# EAGLE schematic speakers2 (EAGLE 5.07)
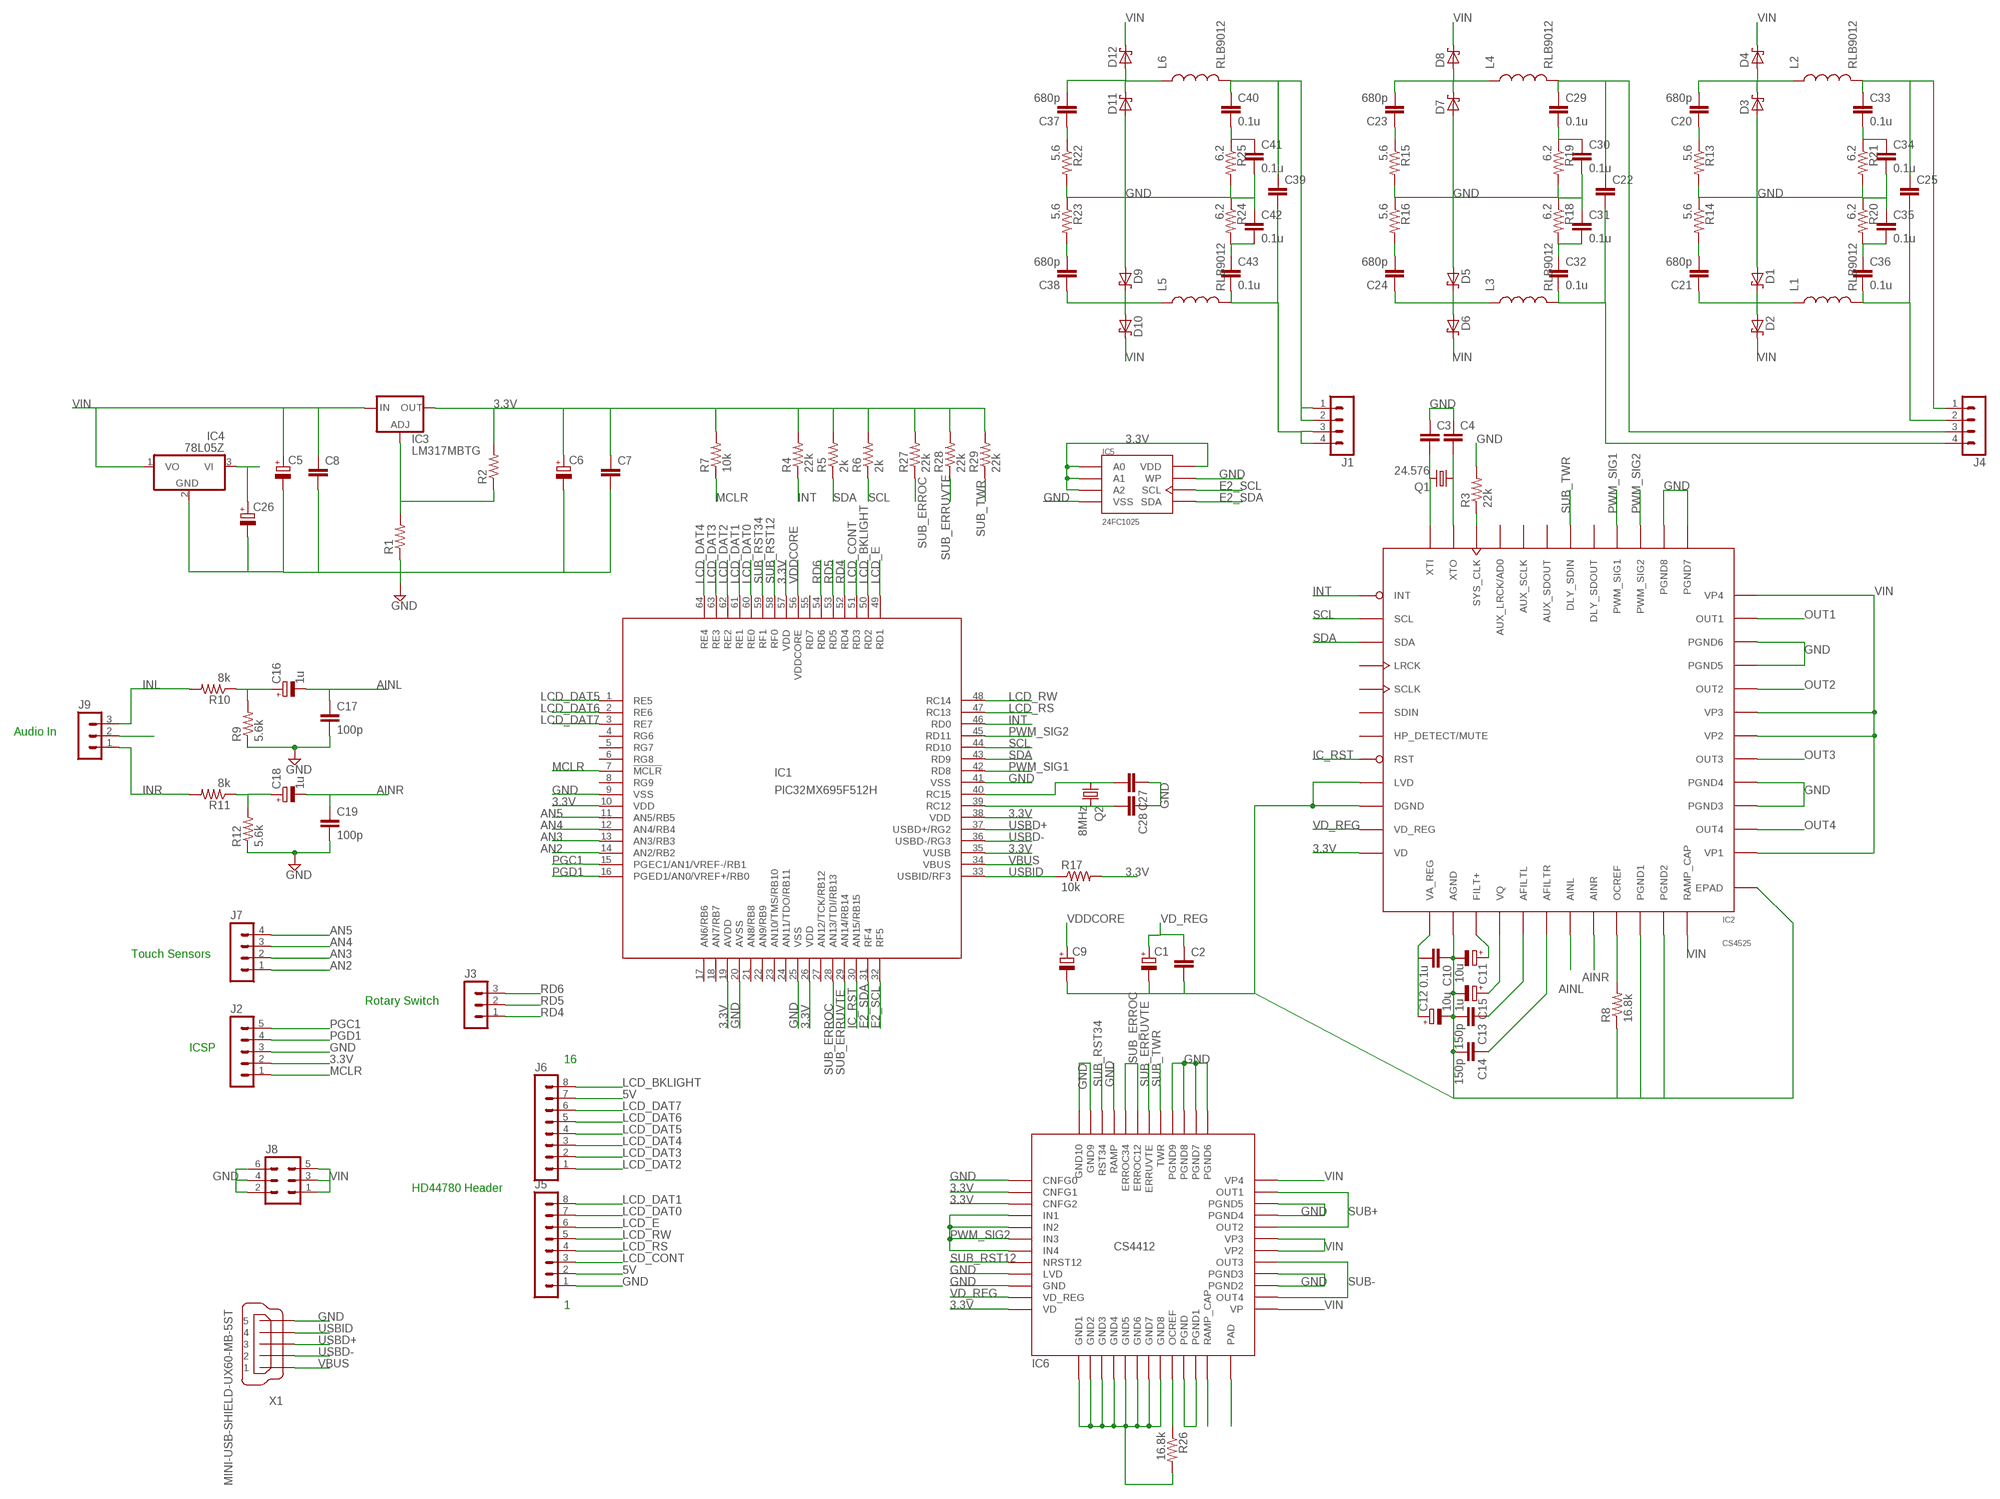
[diagram p0: schematic, sheet 1]

## Parts
C1  CPOL-EUE2-4  [E2-4]
C2  C-EUC0805  [C0805]
C3  C-EUC0805  [C0805]
C4  C-EUC0805  [C0805]
C5  CPOL-EUE2-4  [E2-4]
C6  CPOL-EUE2-4  [E2-4]
C7  C-EUC0805  [C0805]
C8  C-EUC0805  [C0805]
C9  CPOL-EUE2-4  [E2-4]
C10  0.1u  C-EUC0805  [C0805]
C11  10u  CPOL-EUE2-4  [E2-4]
C12  10u  CPOL-EUE2-4  [E2-4]
C13  150p  C-EUC0805  [C0805]
C14  150p  C-EUC0805  [C0805]
C15  1u  CPOL-EUE2-4  [E2-4]
C16  1u  CPOL-EUE2-4  [E2-4]
C17  100p  C-EUC0805  [C0805]
C18  1u  CPOL-EUE2-4  [E2-4]
C19  100p  C-EUC0805  [C0805]
C20  680p  C-EUC0402  [C0402]
C21  680p  C-EUC0402  [C0402]
C22  C-EUC3216  [C3216]
C23  680p  C-EUC0402  [C0402]
C24  680p  C-EUC0402  [C0402]
C25  C-EUC3216  [C3216]
C26  CPOL-EUE2-4  [E2-4]
C27  C-EUC0805  [C0805]
C28  C-EUC0805  [C0805]
C29  0.1u  C-EUC3216  [C3216]
C30  0.1u  C-EUC3216  [C3216]
C31  0.1u  C-EUC3216  [C3216]
C32  0.1u  C-EUC3216  [C3216]
C33  0.1u  C-EUC3216  [C3216]
C34  0.1u  C-EUC3216  [C3216]
C35  0.1u  C-EUC3216  [C3216]
C36  0.1u  C-EUC3216  [C3216]
C37  680p  C-EUC0402  [C0402]
C38  680p  C-EUC0402  [C0402]
C39  C-EUC3216  [C3216]
C40  0.1u  C-EUC3216  [C3216]
C41  0.1u  C-EUC3216  [C3216]
C42  0.1u  C-EUC3216  [C3216]
C43  0.1u  C-EUC3216  [C3216]
D1  SCHOTTKY-DIODESMD  [SMB]
D2  SCHOTTKY-DIODESMD  [SMB]
D3  SCHOTTKY-DIODESMD  [SMB]
D4  SCHOTTKY-DIODESMD  [SMB]
D5  SCHOTTKY-DIODESMD  [SMB]
D6  SCHOTTKY-DIODESMD  [SMB]
D7  SCHOTTKY-DIODESMD  [SMB]
D8  SCHOTTKY-DIODESMD  [SMB]
D9  SCHOTTKY-DIODESMD  [SMB]
D10  SCHOTTKY-DIODESMD  [SMB]
D11  SCHOTTKY-DIODESMD  [SMB]
D12  SCHOTTKY-DIODESMD  [SMB]
IC1  PIC32MX695F512H  [TQFP64-10X10]
IC2  CS4525  [QFN48-9X9]
IC3  LM317MBTG  [TO220L1]
IC4  78L05Z  [TO92]
IC5  24FC1025  [DIL8]
IC6  CS4412  [QFN48-9X9]
J1  MA04-1  [MA04-1]
J2  MA05-1  [MA05-1]
J3  MA03-1  [MA03-1]
J4  MA04-1  [MA04-1]
J5  MA08-1  [MA08-1]
J6  MA08-1  [MA08-1]
J7  MA04-1  [MA04-1]
J8  MA03-2  [MA03-2]
J9  MA03-1  [MA03-1]
L1  RLB9012  [RLB9012]
L2  RLB9012  [RLB9012]
L3  RLB9012  [RLB9012]
L4  RLB9012  [RLB9012]
L5  RLB9012  [RLB9012]
L6  RLB9012  [RLB9012]
Q1  24.576  XTAL-12SMX-B  [12SMX-B]
Q2  8MHz  CRYSTALHC49U-V  [HC49U-V]
R1  R-US_M0805  [M0805]
R2  R-US_M0805  [M0805]
R3  22k  R-US_M0805  [M0805]
R4  22k  R-US_M0805  [M0805]
R5  2k  R-US_M0805  [M0805]
R6  2k  R-US_M0805  [M0805]
R7  10k  R-US_M0805  [M0805]
R8  16.8k  R-US_M0805  [M0805]
R9  5.6k  R-US_M0805  [M0805]
R10  8k  R-US_M0805  [M0805]
R11  8k  R-US_M0805  [M0805]
R12  5.6k  R-US_M0805  [M0805]
R13  5.6  R-US_R0805  [R0805]
R14  5.6  R-US_R0805  [R0805]
R15  5.6  R-US_R0805  [R0805]
R16  5.6  R-US_R0805  [R0805]
R17  10k  R-US_M0805  [M0805]
R18  6.2  R-US_R0805  [R0805]
R19  6.2  R-US_R0805  [R0805]
R20  6.2  R-US_R0805  [R0805]
R21  6.2  R-US_R0805  [R0805]
R22  5.6  R-US_R0805  [R0805]
R23  5.6  R-US_R0805  [R0805]
R24  6.2  R-US_R0805  [R0805]
R25  6.2  R-US_R0805  [R0805]
R26  16.8k  R-US_M0805  [M0805]
R27  22k  R-US_M0805  [M0805]
R28  22k  R-US_M0805  [M0805]
R29  22k  R-US_M0805  [M0805]
X1  MINI-USB-SHIELD-UX60-MB-5ST  [UX60-MB-5ST]

## Nets
3.3V: C6.+ C7.1 IC1.10(VDD) IC1.19(AVDD) IC1.26(VDD) IC1.35(VUSB) IC1.38(VDD) IC1.57(VDD) IC2.12(VD) IC3.2(OUT) IC5.1(A0) IC5.2(A1) IC5.3(A2) IC5.8(VDD) IC6.2(CNFG1) IC6.3(CNFG2) IC6.12(VD) J2.2 R2.2 R4.2 R5.2 R6.2 R7.2 R17.2 R27.2 R28.2 R29.2
5V: C26.+ IC4.3(VI) J5.2 J6.7
AINL: C16.- C17.1 IC2.19(AINL)
AINR: C18.- C19.1 IC2.20(AINR)
AN2: IC1.14(AN2/RB2) J7.1
AN3: IC1.13(AN3/RB3) J7.2
AN4: IC1.12(AN4/RB4) J7.3
AN5: IC1.11(AN5/RB5) J7.4
E2_SCL: IC1.32(RF5) IC5.6(SCL)
E2_SDA: IC1.31(RF4) IC5.5(SDA)
GND: C1.- C2.2 C3.1 C4.1 C5.- C6.- C7.2 C8.2 C9.- C10.1 C11.- C12.- C13.2 C14.2 C15.- C17.2 C19.2 C26.- C27.1 C28.1 C30.2 C31.1 C34.2 C35.1 C41.2 C42.1 D1.A D3.A D5.A D7.A D9.A D11.A IC1.9(VSS) IC1.20(AVSS) IC1.25(VSS) IC1.41(VSS) IC2.9(LVD) IC2.10(DGND) IC2.14(AGND) IC2.22(PGND1) IC2.23(PGND2) IC2.27(PGND3) IC2.28(PGND4) IC2.33(PGND5) IC2.34(PGND6) IC2.37(PGND7) IC2.38(PGND8) IC2.EPAD IC4.2(GND) IC5.4(VSS) IC5.7(WP) IC6.1(CNFG0) IC6.9(LVD) IC6.10(GND) IC6.13(GND1) IC6.14(GND2) IC6.15(GND3) IC6.16(GND4) IC6.17(GND5) IC6.18(GND6) IC6.19(GND7) IC6.20(GND8) IC6.22(PGND) IC6.23(PGND1) IC6.27(PGND2) IC6.28(PGND3) IC6.33(PGND4) IC6.34(PGND5) IC6.37(PGND6) IC6.38(PGND7) IC6.39(PGND8) IC6.40(PGND9) IC6.45(RAMP) IC6.47(GND9) IC6.48(GND10) IC6.EPAD(PAD) J2.3 J5.1 J8.2 J8.4 J8.6 J9.2 R1.1 R3.2 R8.1 R9.1 R12.1 R13.2 R14.1 R15.2 R16.1 R18.1 R19.2 R20.1 R21.2 R22.2 R23.1 R24.1 R25.2 R26.2 X1.5
IC_RST: IC1.30(AN15/RB15) IC2.8(RST)
INL: J9.3 R10.2
INR: J9.1 R11.2
INT: IC1.46(RD0) IC2.1(INT) R4.1
LCD_BKLIGHT: IC1.50(RD2) J6.8
LCD_CONT: IC1.51(RD3) J5.3
LCD_DAT0: IC1.60(RE0) J5.7
LCD_DAT1: IC1.61(RE1) J5.8
LCD_DAT2: IC1.62(RE2) J6.1
LCD_DAT3: IC1.63(RE3) J6.2
LCD_DAT4: IC1.64(RE4) J6.3
LCD_DAT5: IC1.1(RE5) J6.4
LCD_DAT6: IC1.2(RE6) J6.5
LCD_DAT7: IC1.3(RE7) J6.6
LCD_E: IC1.49(RD1) J5.6
LCD_RS: IC1.47(RC13) J5.4
LCD_RW: IC1.48(RC14) J5.5
MCLR: IC1.7(!MCLR) J2.1 R7.1
N$1: IC2.46(SYS_CLK) R3.1
N$2: C11.+ IC2.15(FILT+)
N$3: C21.2 R14.2
N$4: C10.2 C12.+ IC2.13(VA_REG)
N$5: C15.+ IC2.16(VQ)
N$6: C13.1 IC2.17(AFILTL)
N$7: C14.1 IC2.18(AFILTR)
N$8: C20.1 R13.1
N$9: C4.2 IC2.47(XTO) Q1.P$1
N$10: C3.2 IC2.48(XTI) Q1.P$3
N$11: IC3.1(ADJ) R1.2 R2.1
N$12: C27.2 IC1.40(RC15) Q2.1
N$13: C25.1 C33.1 J4.1 L2.2
N$14: C16.+ R9.2 R10.1
N$15: C18.+ R11.1 R12.2
N$16: C28.2 IC1.39(RC12) Q2.2
N$17: C29.2 C30.1 R19.1
N$18: C37.1 R22.1
N$19: C25.2 C36.2 J4.2 L1.2
N$20: C23.1 R15.1
N$21: C39.1 C40.1 J1.1 J1.2 L6.2
N$22: C22.1 C29.1 J4.3 L4.2
N$23: C24.2 R16.2
N$24: C31.2 C32.1 R18.2
N$25: C22.2 C32.2 J4.4 L3.2
N$26: C33.2 C34.1 R21.1
N$27: C35.2 C36.1 R20.2
N$28: C38.2 R23.2
N$29: C39.2 C43.2 J1.3 J1.4 L5.2
N$30: C40.2 C41.1 R25.1
N$31: C42.2 C43.1 R24.2
N$43: IC6.21(OCREF) R26.1
N$52: IC6.24(RAMP_CAP)
OCREF: IC2.21(OCREF) R8.2
OUT1: C21.1 D1.C D2.A IC2.35(OUT1) L1.1
OUT2: C20.2 D3.C D4.A IC2.32(OUT2) L2.1
OUT3: C24.1 D5.C D6.A IC2.29(OUT3) L3.1
OUT4: C23.2 D7.C D8.A IC2.26(OUT4) L4.1
PGC1: IC1.15(PGEC1/AN1/VREF-/RB1) J2.5
PGD1: IC1.16(PGED1/AN0/VREF+/RB0) J2.4
PWM_SIG1: IC1.42(RD8) IC2.40(PWM_SIG1)
PWM_SIG2: IC1.45(RD11) IC2.39(PWM_SIG2) IC6.4(IN1) IC6.5(IN2) IC6.6(IN3) IC6.7(IN4)
RD4: IC1.52(RD4) J3.1
RD5: IC1.53(RD5) J3.2
RD6: IC1.54(RD6) J3.3
SCL: IC1.44(RD10) IC2.2(SCL) R6.1
SDA: IC1.43(RD9) IC2.3(SDA) R5.1
SUB+: C37.2 D11.C D12.A IC6.32(OUT2) IC6.35(OUT1) L6.1
SUB-: C38.1 D9.C D10.A IC6.26(OUT4) IC6.29(OUT3) L5.1
SUB_ERROC: IC1.28(AN13/TDI/RB13) IC6.43(ERROC12) IC6.44(ERROC34) R27.1
SUB_ERRUVTE: IC1.29(AN14/RB14) IC6.42(ERRUVTE) R28.1
SUB_RST12: IC1.58(RF0) IC6.8(NRST12)
SUB_RST34: IC1.59(RF1) IC6.46(RST34)
SUB_TWR: IC2.42(DLY_SDIN) IC6.41(TWR) R29.1
USBD+: IC1.37(USBD+/RG2) X1.3
USBD-: IC1.36(USBD-/RG3) X1.2
USBID: IC1.33(USBID/RF3) R17.1 X1.4
VBUS: IC1.34(VBUS) X1.1
VD_REG: C1.+ C2.1 IC2.11(VD_REG) IC6.11(VD_REG)
VDDCORE: C9.+ IC1.56(VDDCORE)
VIN: C5.+ C8.1 D2.C D4.C D6.C D8.C D10.C D12.C IC2.24(RAMP_CAP) IC2.25(VP1) IC2.30(VP2) IC2.31(VP3) IC2.36(VP4) IC3.3(IN) IC4.1(VO) IC6.25(VP) IC6.30(VP2) IC6.31(VP3) IC6.36(VP4) J8.1 J8.3 J8.5
Unconnected: IC1.4(RG6) IC1.5(RG7) IC1.6(RG8) IC1.8(RG9) IC1.17(AN6/RB6) IC1.18(AN7/RB7) IC1.21(AN8/RB8) IC1.22(AN9/RB9) IC1.23(AN10/TMS/RB10) IC1.24(AN11/TDO/RB11) IC1.27(AN12/TCK/RB12) IC1.55(RD7) IC2.4(LRCK) IC2.5(SCLK) IC2.6(SDIN) IC2.7(HP_DETECT/MUTE) IC2.41(DLY_SDOUT) IC2.43(AUX_SDOUT) IC2.44(AUX_SCLK) IC2.45(AUX_LRCK/AD0) X1.M1(S1) X1.M2(S2) X1.M3(S3) X1.M4(S4)

## Notes on the sheet
- Audio In
- Touch Sensors
- Rotary Switch
- ICSP
- 16
- HD44780 Header
- 1

## Library data of the parts
C1 C5 C6 C9 C11 C12 C15 C16 C18 C26 = resistor:CPOL-EU: POLARIZED CAPACITOR, European symbol
C2-C4 C7 C8 C10 C13 C14 C17 C19-C25 C27-C43 = resistor:C-EU: CAPACITOR, European symbol
D1-D12 = diode:SCHOTTKY-DIODE: Schottky Diode
IC1 = bnahill:PIC32MX695F512H: PIC32MC695F512H 64-pin 32-bit 10/100 ethernet and USB-capable uC
IC2 = bnahill:CS4525: CS4525 - 30 W Digital Audio Amplifier with Integrated ADC
IC3 = v-reg:LM317?*: 500 mA Adjustable Output Positive Voltage Regulator Source: http://www.onsemi.co.jp .. LM317M-D.PDF
IC4 = linear:78*: Positive VOLTAGE REGULATOR Source: http://cache.national.com/ds/LM/LM78L05.pdf http://www.fairchildsemi.com/ds/LM/LM7805.pdf
IC5 = bnahill:24FC1025
IC6 = bnahill:CS4412
J1 J4 J7 = con-lstb:MA04-1: PIN HEADER
J2 = con-lstb:MA05-1: PIN HEADER
J3 J9 = con-lstb:MA03-1: PIN HEADER
J5 J6 = con-lstb:MA08-1: PIN HEADER
J8 = con-lstb:MA03-2: PIN HEADER
L1-L6 = bnahill:RLB9012: RLB9012 Radial Inductor
Q1 = bnahill:XTAL-12SMX-B
Q2 = crystal:CRYSTAL: CRYSTAL
R1-R29 = resistor:R-US_: RESISTOR, American symbol
X1 = con-hirose:MINI-USB-SHIELD-: MINI USB Connector Source: http://www.hirose.co.jp/cataloge_hp/e24000019.pdf